# Altium schematic sheet uSD.SchDoc
size A4; SheetNumber: 14; SheetTotal: 14
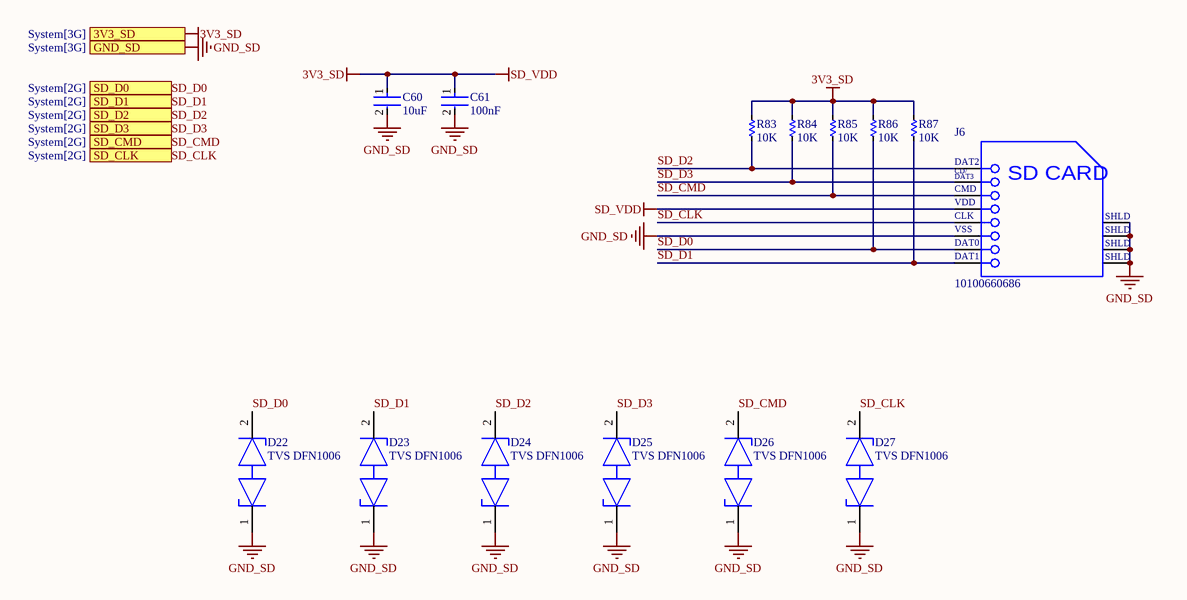
[diagram p0: uSD.SchDoc]

## Parts
C60  10uF  [FP-GRM18-0_15-MFG]
C61  100nF  [FP-GRM18-0_15-MFG]
D22  TVS DFN1006  [FP-SOD882-CA-MFG]
D23  TVS DFN1006  [FP-SOD882-CA-MFG]
D24  TVS DFN1006  [FP-SOD882-CA-MFG]
D25  TVS DFN1006  [FP-SOD882-CA-MFG]
D26  TVS DFN1006  [FP-SOD882-CA-MFG]
D27  TVS DFN1006  [FP-SOD882-CA-MFG]
J6  10100660686  [AMPH-10100660686_V]
R83  10K  [RES-SMD-0603]
R84  10K  [RES-SMD-0603]
R85  10K  [RES-SMD-0603]
R86  10K  [RES-SMD-0603]
R87  10K  [RES-SMD-0603]

## Ports
3V3_SD (see System[3G]), GND_SD (see System[3G]), SD_CLK (see System[2G]), SD_CMD (see System[2G]), SD_D0 (see System[2G]), SD_D1 (see System[2G]), SD_D2 (see System[2G]), SD_D3 (see System[2G])

## Nets
3V3_SD: C60.1 C61.1 J6.4(VDD) R83.2 R84.2 R85.2 R86.2 R87.2 ; port 3V3_SD  [also labelled SD_VDD]
GND_SD: C60.2 C61.2 D22.1(K1) D23.1(K1) D24.1(K1) D25.1(K1) D26.1(K1) D27.1(K1) J6.6(VSS) J6.9(SHLD) J6.10(SHLD) J6.11(SHLD) J6.12(SHLD) ; port GND_SD
SD_CLK: D27.2(K2) J6.5(CLK) ; port SD_CLK
SD_CMD: D26.2(K2) J6.3(CMD) R85.1 ; port SD_CMD
SD_D0: D22.2(K2) J6.7(DAT0) R86.1 ; port SD_D0
SD_D1: D23.2(K2) J6.8(DAT1) R87.1 ; port SD_D1
SD_D2: D24.2(K2) J6.1(DAT2) R83.1 ; port SD_D2
SD_D3: D25.2(K2) J6.2(CD/DAT3) R84.1 ; port SD_D3

## Notes on the sheet
- (in symbol CMP-2000-05564-1) CD/; DAT3; SD CARD

## Library data of the parts
C60 = CMP-2000-05448-2: CAP CER 10V X5R 0603; Manufacturer Part Number: GRM188R61A106KE69D; Manufacturer: Murata; Temperature Coefficient: 15%; Material: Ceramic; Tolerance: 10%; Device Class L1: Passive Components; ComponentLink2Description: Datasheet; Height: 0.95mm; Package: GRM18-0.15; Octopart: https://octopart.com/grm188r61a106ke69d-murata-22851381; Value: 10uF; Digikey Description: CAP CER 10UF 10V X5R 0603; Temperature Range High: +85°C; Temperature Range Low: -55°C; Temperature Characteristic: X5R; Capacitance: 10uF; RoHS: TRUE; Device Class L2: Capacitors; ComponentLink2URL: https://search.murata.co.jp/Ceramy/image/img/A01X/G101/ENG/GRM188R61A106KE69-01A.pdf; Device Class L3: Ceramic Capacitors; Lead Free: Yes; Mouser Description: Multilayer Ceramic Capacitors MLCC - SMD/SMT 0603 10uF 10volts X5R + - 10%; Category: Cap; Voltage Rating: 10V; Temperature: -55°C to +85°C; Automotive: No
C61 = CMP-2000-05448-2: CAP CER 10V X5R 0603; Manufacturer Part Number: GRM188R61A106KE69D; Manufacturer: Murata; Temperature Coefficient: 15%; Value: 10uF; Material: Ceramic; Tolerance: 10%; Device Class L1: Passive Components; ComponentLink2Description: Datasheet; Height: 0.95mm; Package: GRM18-0.15; Octopart: https://octopart.com/grm188r61a106ke69d-murata-22851381; Digikey Description: CAP CER 10UF 10V X5R 0603; Temperature Range High: +85°C; Temperature Range Low: -55°C; Temperature Characteristic: X5R; Capacitance: 10uF; RoHS: TRUE; Device Class L2: Capacitors; ComponentLink2URL: https://search.murata.co.jp/Ceramy/image/img/A01X/G101/ENG/GRM188R61A106KE69-01A.pdf; Device Class L3: Ceramic Capacitors; Lead Free: Yes; Mouser Description: Multilayer Ceramic Capacitors MLCC - SMD/SMT 0603 10uF 10volts X5R + - 10%; Category: Cap; Voltage Rating: 10V; Temperature: -55°C to +85°C; Automotive: No
D22-D27 = CMP-14436-000021-1: PESDNC2FD3V3B TVS DIODE DFN1006; RoHS Compliant: Yes; ComponentLink1Description: New link; ComponentLink1URL: https://linhkien.cxtvn.com/9728-pesdnc2fd3v3b-tvs-diode-dfn1006.html
J6 = CMP-2000-05564-1: Micro SD Card Reader, -25 to 85 degC, 9-Pin SMD, RoHS, Tape and Reel; Manufacturer: Amphenol; Pitch: 1.1mm; Package Version: Rev. G, 10/2012; No. of Positions: 9; Package Description: 9-Pin Micro Secure Digital Card, Pitch 1.1 mm; Datasheet URL: https://www.amphenolcanada.com/ProductSearch/drawings/AC/10100660686.pdf; Orientation: RightAngle; Mounting Technology: SurfaceMount; Manufacturer URL: http://www.amphenol.com/; Package URL: https://www.amphenolcanada.com/ProductSearch/drawings/AC/10100660686.pdf; Temperature Min: -25degC; Package Reference: 10100660686; Temperature Max: 85degC; PartNumber: 10100660; Packing: TapeandReel; RoHS: TRUE; Datasheet Version: Rev. G, 10/2012
R83-R87 = Res-SMD: Res 0603 5%; Manufacturer: Generic Components; Class: Passive; Published: 08/06/2000; Publisher: Altium Hobart Technology Centre